# EAGLE schematic F0-lamp (EAGLE 9.6.1)
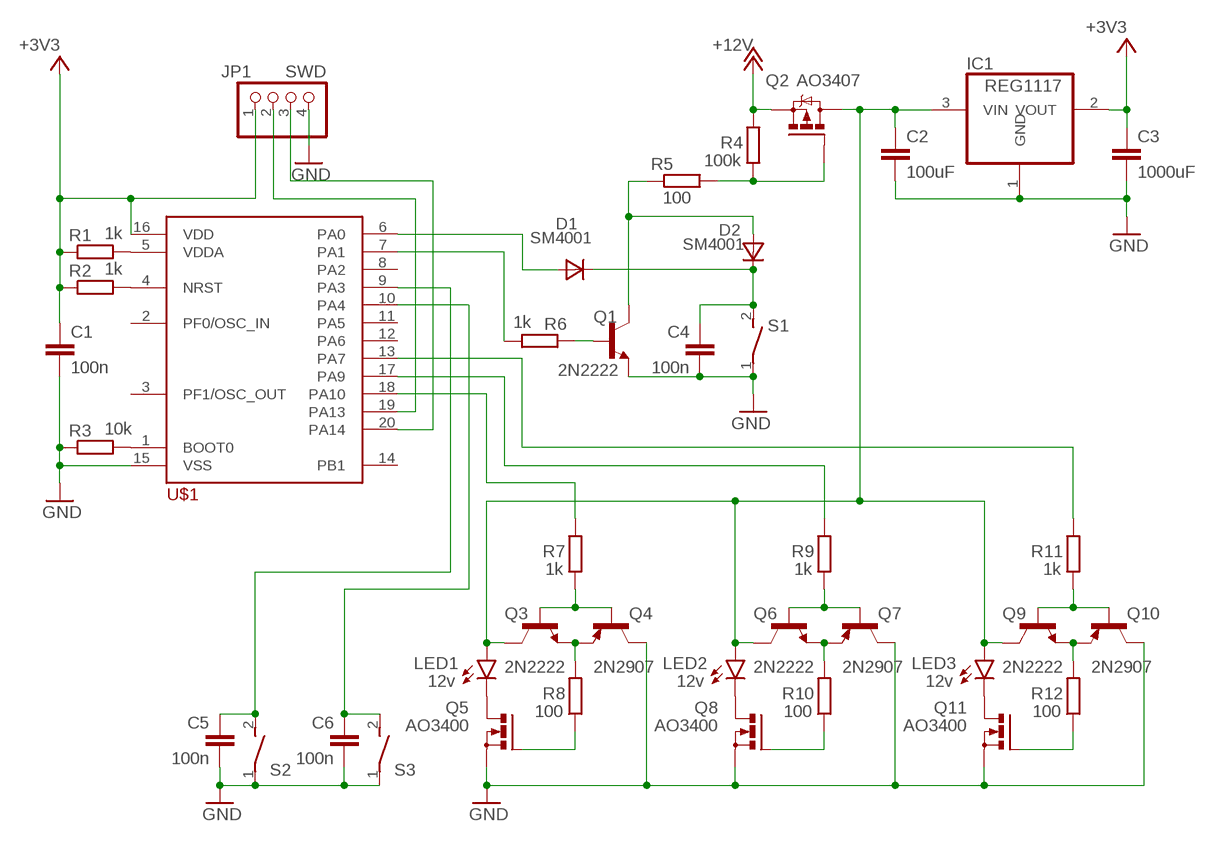
[diagram p0: schematic, sheet 1]

## Parts
C1  100n  C-EUC0805  [C0805]
C2  100uF  C-EUC0805  [C0805]
C3  1000uF  C-EUC0805  [C0805]
C4  100n  C-EUC0805  [C0805]
C5  100n  C-EUC0805  [C0805]
C6  100n  C-EUC0805  [C0805]
D1  SM4001  [MELF-MLL41]
D2  SM4001  [MELF-MLL41]
IC1  REG1117  [SOT223]
JP1  SWD  PINHD-1X4  [1X04]
LED1  12v  LED-LUMILED+  [LUMILED+]
LED2  12v  LED-LUMILED+  [LUMILED+]
LED3  12v  LED-LUMILED+  [LUMILED+]
Q1  2N2222  [TO18]
Q2  AO3407  IRF4905  [TO220BH]
Q3  2N2222  [TO18]
Q4  2N2907  [TO18]
Q5  AO3400  PMOSFET_NTO220BV  [TO220BV]
Q6  2N2222  [TO18]
Q7  2N2907  [TO18]
Q8  AO3400  PMOSFET_NTO220BV  [TO220BV]
Q9  2N2222  [TO18]
Q10  2N2907  [TO18]
Q11  AO3400  PMOSFET_NTO220BV  [TO220BV]
R1  1k  R-EU_1812X7R  [1812X7R]
R2  1k  R-EU_1812X7R  [1812X7R]
R3  10k  R-EU_1812X7R  [1812X7R]
R4  100k  R-EU_1812X7R  [1812X7R]
R5  100  R-EU_1812X7R  [1812X7R]
R6  1k  R-EU_1812X7R  [1812X7R]
R7  1k  R-EU_1812X7R  [1812X7R]
R8  100  R-EU_1812X7R  [1812X7R]
R9  1k  R-EU_1812X7R  [1812X7R]
R10  100  R-EU_1812X7R  [1812X7R]
R11  1k  R-EU_1812X7R  [1812X7R]
R12  100  R-EU_1812X7R  [1812X7R]
S1  Button  SWITCH_01  [SWITCH_01]
S2  Button  SWITCH_01  [SWITCH_01]
S3  Button  SWITCH_01  [SWITCH_01]
U$1  STM32F030F4  [TSSOP20]

## Nets
+3V3: C1.1 C3.1 IC1.2(VOUT) JP1.1 R1.1 R2.1 U$1.16(VDD)
+12V: Q2.S R4.2
GND: C1.2 C2.2 C3.2 C4.2 C5.2 C6.2 IC1.1(GND) JP1.4 Q1.1(E) Q4.3(C) Q5.S Q7.3(C) Q8.S Q10.3(C) Q11.S R3.1 S1.1 S2.1 S3.1 U$1.15(VSS)
N$1: R1.2 U$1.5(VDDA)
N$2: JP1.2 U$1.19(PA13)
N$3: JP1.3 U$1.20(PA14)
N$4: R3.2 U$1.1(BOOT0)
N$5: C2.1 IC1.3(VIN) LED1.2+(A) LED2.2+(A) LED3.2+(A) Q2.D Q3.3(C) Q6.3(C) Q9.3(C)
N$6: R2.2 U$1.4(NRST)
N$7: Q2.G R4.1 R5.1
N$8: D2.A Q1.3(C) R5.2
N$9: C4.1 D1.C D2.C S1.2
N$10: Q1.2(B) R6.1
N$11: R6.2 U$1.7(PA1)
N$12: D1.A U$1.6(PA0)
N$13: C5.1 S2.2 U$1.9(PA3)
N$15: Q3.1(E) Q4.1(E) R8.2
N$16: Q3.2(B) Q4.2(B) R7.1
N$17: LED1.4-(C) Q5.D
N$19: Q5.G R8.1
N$20: Q6.1(E) Q7.1(E) R10.2
N$21: Q6.2(B) Q7.2(B) R9.1
N$22: LED2.4-(C) Q8.D
N$24: Q8.G R10.1
N$25: Q9.1(E) Q10.1(E) R12.2
N$26: Q9.2(B) Q10.2(B) R11.1
N$27: LED3.4-(C) Q11.D
N$29: Q11.G R12.1
N$32: R9.2 U$1.17(PA9)
N$33: R7.2 U$1.18(PA10)
N$34: R11.2 U$1.13(PA7)
N$35: C6.1 S3.2 U$1.10(PA4)
Unconnected: U$1.2(PF0/OSC_IN) U$1.3(PF1/OSC_OUT) U$1.8(PA2) U$1.11(PA5) U$1.12(PA6) U$1.14(PB1)

## Library data of the parts
C1-C6 = rcl:C-EU: CAPACITOR, European symbol; SPICEPREFIX: C
D1 D2 = _mod_diode:SM400*: SM4001 .. SM4007 General Purpose Rectifier, 1 A SMD-Version of 1N4001 .. 1N4007 Case: MELF-MLL41 = DO 213 AB Author: Dipl.-Ing. FH Rainer Bayer HHN Hochschule Heilbronn, rainer.bayer@hs-heilbronn.de Ingenieurbüro ing-rb, mail@ing-rb.de
IC1 = burr-brown:REG1117: 800mA and 1A Low Dropout (LDO) Positive Regulator 1.8V, 2.5V, 2.85V, 3.3V, 5V, and Adj; MPN: REG1117; OC_FARNELL: 1097566; OC_NEWARK: 14P6981
JP1 = pinhead:PINHD-1X4: PIN HEADER
LED1-LED3 = led:LED: LED OSRAM: - CHIPLED LG R971, LG N971, LY N971, LG Q971, LY Q971, LO R971, LY R971 LH N974, LH R974 LS Q976, LO Q976, LY Q976 LO Q996 - Hyper CHIPLED LW Q18S LB Q993, LB Q99A, LB R99A - SideLED LS A670, LO A670, LY A670, LG A670, LP A670 LB A673, LV A673, LT A673, LW A673 LH A674 LY A675 LS A676, LA A676, LO A676, LY A676, LW A676 LS A679, LY A679, LG A679 - Hyper Micro SIDELED® LS Y876, LA Y876, LO Y876, LY Y876 LT Y87S - SmartLED LW L88C, LW L88S LB L89C, LB L89S, LG L890 LS L89K, LO L89K, LY L89K LS L896, LA L896, LO L896, LY L896 - TOPLED LS T670, LO T670, LY T670, LG T670, LP T670 LSG T670, LSP T670, LSY T670, LOP T670, LYG T670 LG T671, LOG T671, LSG T671 LB T673, LV T673, LT T673, LW T673 LH T674 LS T676, LA T676, LO T676, LY T676, LB T676, LH T676, LSB T676, LW T676 LB T67C, LV T67C, LT T67C, LS T67K, LO T67K, LY T67K, LW E67C LS E67B, LA E67B, LO E67B, LY E67B, LB E67C, LV E67C, LT E67C LW T67C LS T679, LY T679, LG T679 LS T770, LO T770, LY T770, LG T770, LP T770 LB T773, LV T773, LT T773, LW T773 LH T774 LS E675, LA E675, LY E675, LS T675 LS T776, LA T776, LO T776, LY T776, LB T776 LHGB T686 LT T68C, LB T68C - Hyper Mini TOPLED® LB M676 - Mini TOPLED Santana® LG M470 LS M47K, LO M47K, LY M47K Source: http://www.osram.convergy.de LUXEON: - LUMILED® LXK2-PW12-R00, LXK2-PW12-S00, LXK2-PW14-U00, LXK2-PW14-V00 LXK2-PM12-R00, LXK2-PM12-S00, LXK2-PM14-U00 LXK2-PE12-Q00, LXK2-PE12-R00, LXK2-PE12-S00, LXK2-PE14-T00, LXK2-PE14-U00 LXK2-PB12-K00, LXK2-PB12-L00, LXK2-PB12-M00, LXK2-PB14-N00, LXK2-PB14-P00, LXK2-PB14-Q00 LXK2-PR12-L00, LXK2-PR12-M00, LXK2-PR14-Q00, LXK2-PR14-R00 LXK2-PD12-Q00, LXK2-PD12-R00, LXK2-PD12-S00 LXK2-PH12-R00, LXK2-PH12-S00 LXK2-PL12-P00, LXK2-PL12-Q00, LXK2-PL12-R00 Source: www.luxeon.com KINGBRIGHT: KA-3528ASYC Source: www.kingbright.com
Q1 Q3 Q6 Q9 = transistor-npn:2N2222*: NPN Transistor
Q2 = transistor-power:IRF4905: P-Channel HEXFET® Power MOSFET RDS(on)= 0.02 Ohm, ID = -74A Source: http://www.irf.com/product-info/datasheets/data/irf4905pbf.pdf
Q4 Q7 Q10 = transistor-pnp:2N2907*: PNP Transistor
Q5 Q8 Q11 = transistor-power:PMOSFET_N: Power MOSFET N-Channel
R1-R12 = rcl:R-EU_: RESISTOR, European symbol; SPICEPREFIX: R
S1-S3 = m-pad-2.1:SWITCH_01
U$1 = stm32f030f4:STM32F030F4